# Altium schematic sheet control.SchDoc
size A3; SheetNumber: 1; SheetTotal: 1
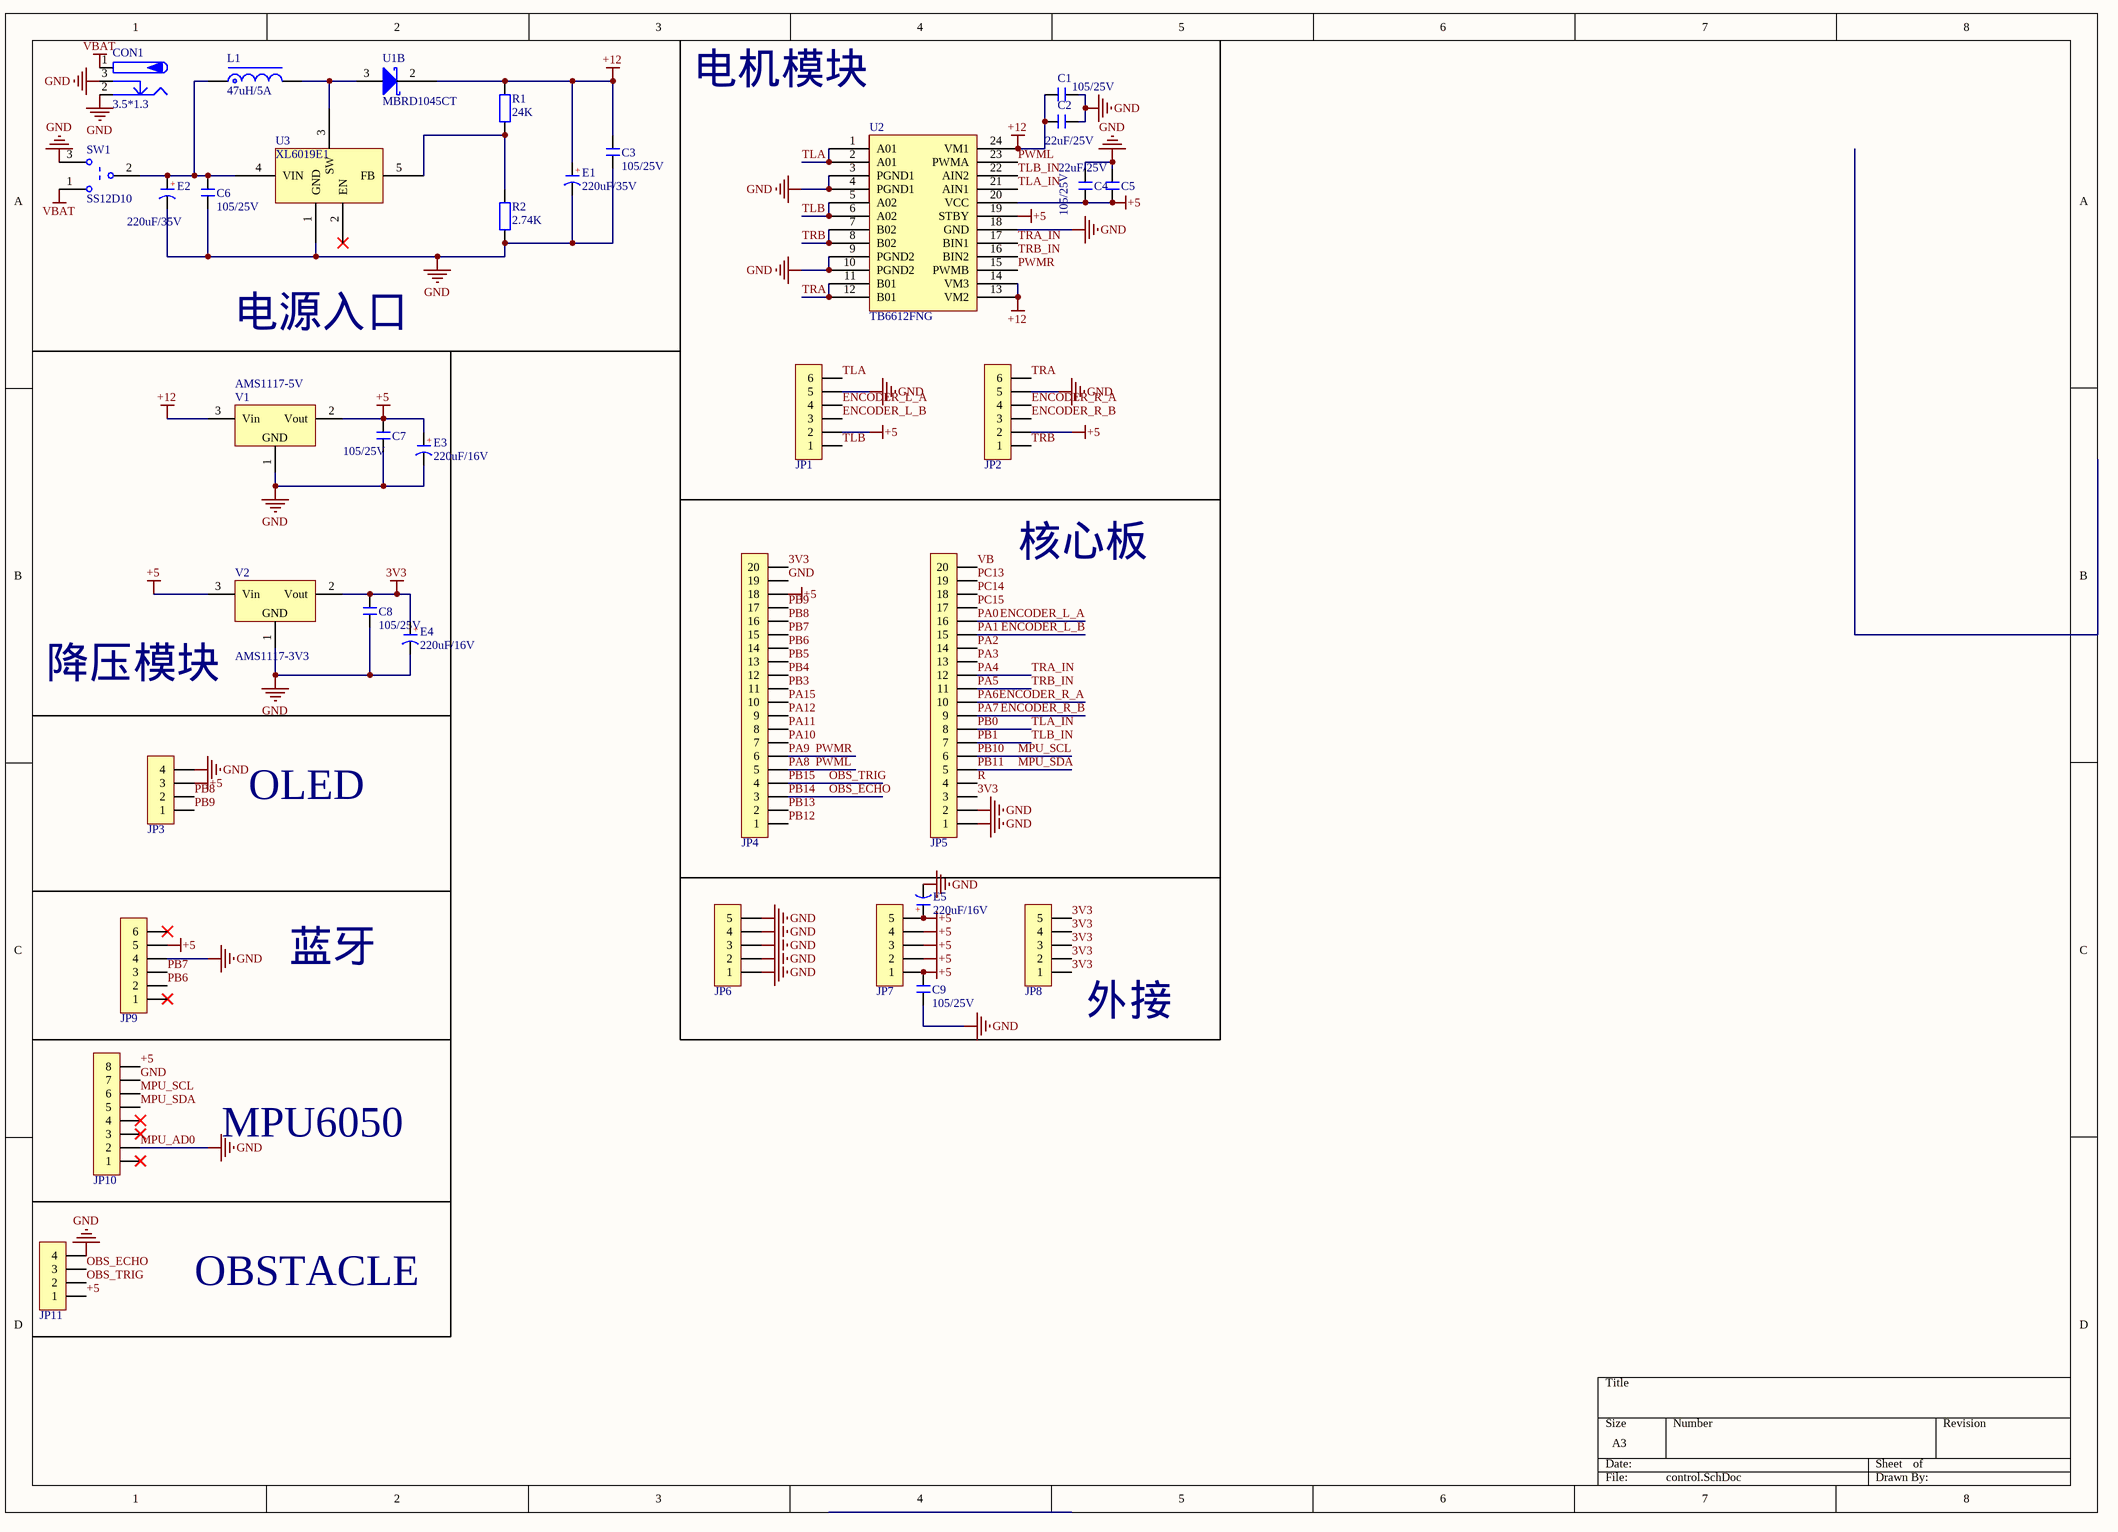
[diagram p0: control.SchDoc]

## Parts
C1  105/25V  [C 0603_M]
C2  22uF/25V  [C 0805_M]
C3  105/25V  [C 0603_M]
C4  105/25V  [C 0603_M]
C5  22uF/25V  [C 0805_M]
C6  105/25V  [C 0603_M]
C7  105/25V  [C 0603_M]
C8  105/25V  [C 0603_M]
C9  105/25V  [C 0603_M]
CON1  3.5*1.3  [DC-005]
E1  220uF/35V  [CM E(8*10.2)]
E2  220uF/35V  [CM E(8*10.2)]
E3  220uF/16V  [CD D(7343)]
E4  220uF/16V  [CD D(7343)]
E5  220uF/16V  [CD D(7343)]
JP1  HDR-1X6  [XH2.54-LI-6P]  (value not drawn)
JP2  HDR-1X6  [XH2.54-LI-6P]  (value not drawn)
JP3  HDR-1X4  [HDR2.54-M-LI-4P]  (value not drawn)
JP4  HDR-1X20  [HDR2.54-M-LI-20P]  (value not drawn)
JP5  HDR-1X20  [HDR2.54-M-LI-20P]  (value not drawn)
JP6  HDR-1X5  [HDR2.54-LI-5P]  (value not drawn)
JP7  HDR-1X5  [HDR2.54-LI-5P]  (value not drawn)
JP8  HDR-1X5  [HDR2.54-LI-5P]  (value not drawn)
JP9  HDR-1X6  [HDR2.54-M-LI-6P]  (value not drawn)
JP10  HDR-1X8  [HDR2.54-M-LI-8P]  (value not drawn)
JP11  HDR-1X4  [HDR2.54-M-LI-4P]  (value not drawn)
L1  47uH/5A  [LMR135]
R1  24K  [R 0603_M]
R2  2.74K  [R 0603_M]
SW1  SS12D10  [SS12D10]
U1  MBRD1045CT  [TO-252-3_L6.5-W5.5-P4.6-LS9.5-BL]  (part B of 2)
U2  TB6612FNG  [TSOP65P760X160-24N]
U3  XL6019E1  [TO-263-5]
V1  AMS1117-5V  [SOT223_L]
V2  AMS1117-3V3  [SOT223_L]

## Nets
3V3: C8.2 E4.1(A) JP4.20 JP5.3 JP8.1 JP8.2 JP8.3 JP8.4 JP8.5 V2.2(Vout)
+5: C4.2 C5.2 C7.2 C9.2 E3.1(A) E5.1(A) JP1.2 JP2.2 JP3.3 JP4.18 JP7.1 JP7.2 JP7.3 JP7.4 JP7.5 JP9.5 JP10.8 JP11.1 U2.19(STBY) U2.20(VCC) V1.2(Vout) V2.3(Vin)
+12: C1.2 C2.2 C3.2 E1.1(A) R1.2 U1.2 U2.13(VM2) U2.14(VM3) U2.24(VM1) V1.3(Vin)
GND: C1.1 C2.1 C3.1 C4.1 C5.1 C6.1 C7.1 C8.1 C9.1 CON1.2 CON1.3 E1.2(K) E2.2(K) E3.2(K) E4.2(K) E5.2(K) JP1.5 JP2.5 JP3.4 JP4.19 JP5.1 JP5.2 JP6.1 JP6.2 JP6.3 JP6.4 JP6.5 JP9.4 JP10.2 JP10.7 JP11.4 R2.2 SW1.3(NO1) U2.3(PGND1) U2.4(PGND1) U2.9(PGND2) U2.10(PGND2) U2.18(GND) U3.1(GND) V1.1(GND) V2.1(GND)  [also labelled MPU_AD0]
VBAT: CON1.1 SW1.1(NC1)
ENCODER_L_A: JP1.4 JP5.16  [also labelled PA0]
ENCODER_L_B: JP1.3 JP5.15  [also labelled PA1]
ENCODER_R_A: JP2.4 JP5.10  [also labelled PA6]
ENCODER_R_B: JP2.3 JP5.9  [also labelled PA7]
MPU_SCL: JP5.6 JP10.6  [also labelled PB10]
MPU_SDA: JP5.5 JP10.5  [also labelled PB11]
OBS_ECHO: JP4.3 JP11.3  [also labelled PB14]
OBS_TRIG: JP4.4 JP11.2  [also labelled PB15]
PA2: JP5.14
PA3: JP5.13
PA4: JP5.12 U2.17(BIN1)  [also labelled TRA_IN]
PA5: JP5.11 U2.16(BIN2)  [also labelled TRB_IN]
PA8: JP4.5 U2.23(PWMA)  [also labelled PWML]
PA9: JP4.6 U2.15(PWMB)  [also labelled PWMR]
PA10: JP4.7
PA11: JP4.8
PA12: JP4.9
PA15: JP4.10
PB0: JP5.8 U2.21(AIN1)  [also labelled TLA_IN]
PB1: JP5.7 U2.22(AIN2)  [also labelled TLB_IN]
PB3: JP4.11
PB4: JP4.12
PB5: JP4.13
PB6: JP4.14 JP9.2
PB7: JP4.15 JP9.3
PB8: JP3.2 JP4.16
PB9: JP3.1 JP4.17
PB12: JP4.1
PB13: JP4.2
PC13: JP5.19
PC14: JP5.18
PC15: JP5.17
R: JP5.4
TLA: JP1.6 U2.1(A01) U2.2(A01)
TLB: JP1.1 U2.5(A02) U2.6(A02)
TRA: JP2.6 U2.11(B01) U2.12(B01)
TRB: JP2.1 U2.7(B02) U2.8(B02)
VB: JP5.20
NetC6_2: C6.2 E2.1(A) L1.1 SW1.2(COM2) U3.4(VIN)
NetL1_2: L1.2 U1.3(A) U3.3(SW)
NetR1_1: R1.1 R2.1 U3.5(FB)

Not connected (* = marked no-connect by the designer): JP9 1* 6*; JP10 1* 3* 4*; U3 2(EN)*

## Notes on the sheet
- 电机模块
- 电源入口
- 核心板
- 降压模块
- OLED
- 蓝牙
- (near JP8) 外接
- MPU6050
- OBSTACLE
- (in symbol CE_SMD) +
- (in symbol CT) +

## Library data of the parts
C1-C9 = C: 贴片电容; BOM名称: 无极性贴片电容; 淘宝ID: 封装库来自淘宝 ID：黄晶宝石; 联系售后，技术支持: https://shop463601444.taobao.com; 唯一出售店铺网址: https://shop463601444.taobao.com
CON1 = P-DC: 低压电源接口; BOM名称: DC电源接口; 版权归属: 封装库来自淘宝 ID：黄晶宝石; 学习资源: https://shop463601444.taobao.com
E1 E2 = CE_SMD: 贴片电解电容; 版权归属: 封装库来自淘宝 ID：黄晶宝石; BOM名称: 贴片电解电容; 联系售后: https://shop463601444.taobao.com
E3-E5 = CT: 贴片钽电容; 淘宝ID: 封装库来自淘宝 ID：黄晶宝石; BOM名称: 贴片钽电容; 联系售后: https://shop463601444.taobao.com
JP1 JP2 JP9 = Header 6: 6P接插件; 版权归属: 封装库来自淘宝 ID：黄晶宝石; BOM名称: 6P接插件; 学习资源: https://shop463601444.taobao.com
JP3 JP11 = Header 4: 4P接插件; 版权归属: 封装库来自淘宝 ID：黄晶宝石; BOM名称: 4P接插件; 学习资源: https://shop463601444.taobao.com
JP4 JP5 = Header 20: 20P接插件; 版权归属: 封装库来自淘宝 ID：黄晶宝石; BOM名称: 20P接插件; 学习资源: https://shop463601444.taobao.com
JP6-JP8 = Header 5: 5P接插件; 版权归属: 封装库来自淘宝 ID：黄晶宝石; BOM名称: 5P接插件; 学习资源: https://shop463601444.taobao.com
JP10 = Header 8: 8P接插件; 版权归属: 封装库来自淘宝 ID：黄晶宝石; BOM名称: 8P接插件; 学习资源: https://shop463601444.taobao.com
L1 = L-MR: 功率磁环电感; 淘宝ID: 封装库来自淘宝 ID：黄晶宝石; BOM名称: 功率磁环电感; 联系售后: https://shop463601444.taobao.com
R1 R2 = R: 贴片电阻; 版权归属: 来自淘宝 ID：黄晶宝石; 封装库来自淘宝卖家 ID：黄晶宝石: 其他店铺购入均为盗版，不享受售后技术支持服务，请立即申请退款; BOM名称: 贴片电阻; 联系售后: https://shop463601444.taobao.com
V1 V2 = AMS1117: 三端稳压芯片; BOM名称: 稳压芯片; 淘宝ID: 封装库来自淘宝 ID：黄晶宝石; 欢迎光临淘宝店铺: https://shop463601444.taobao.com